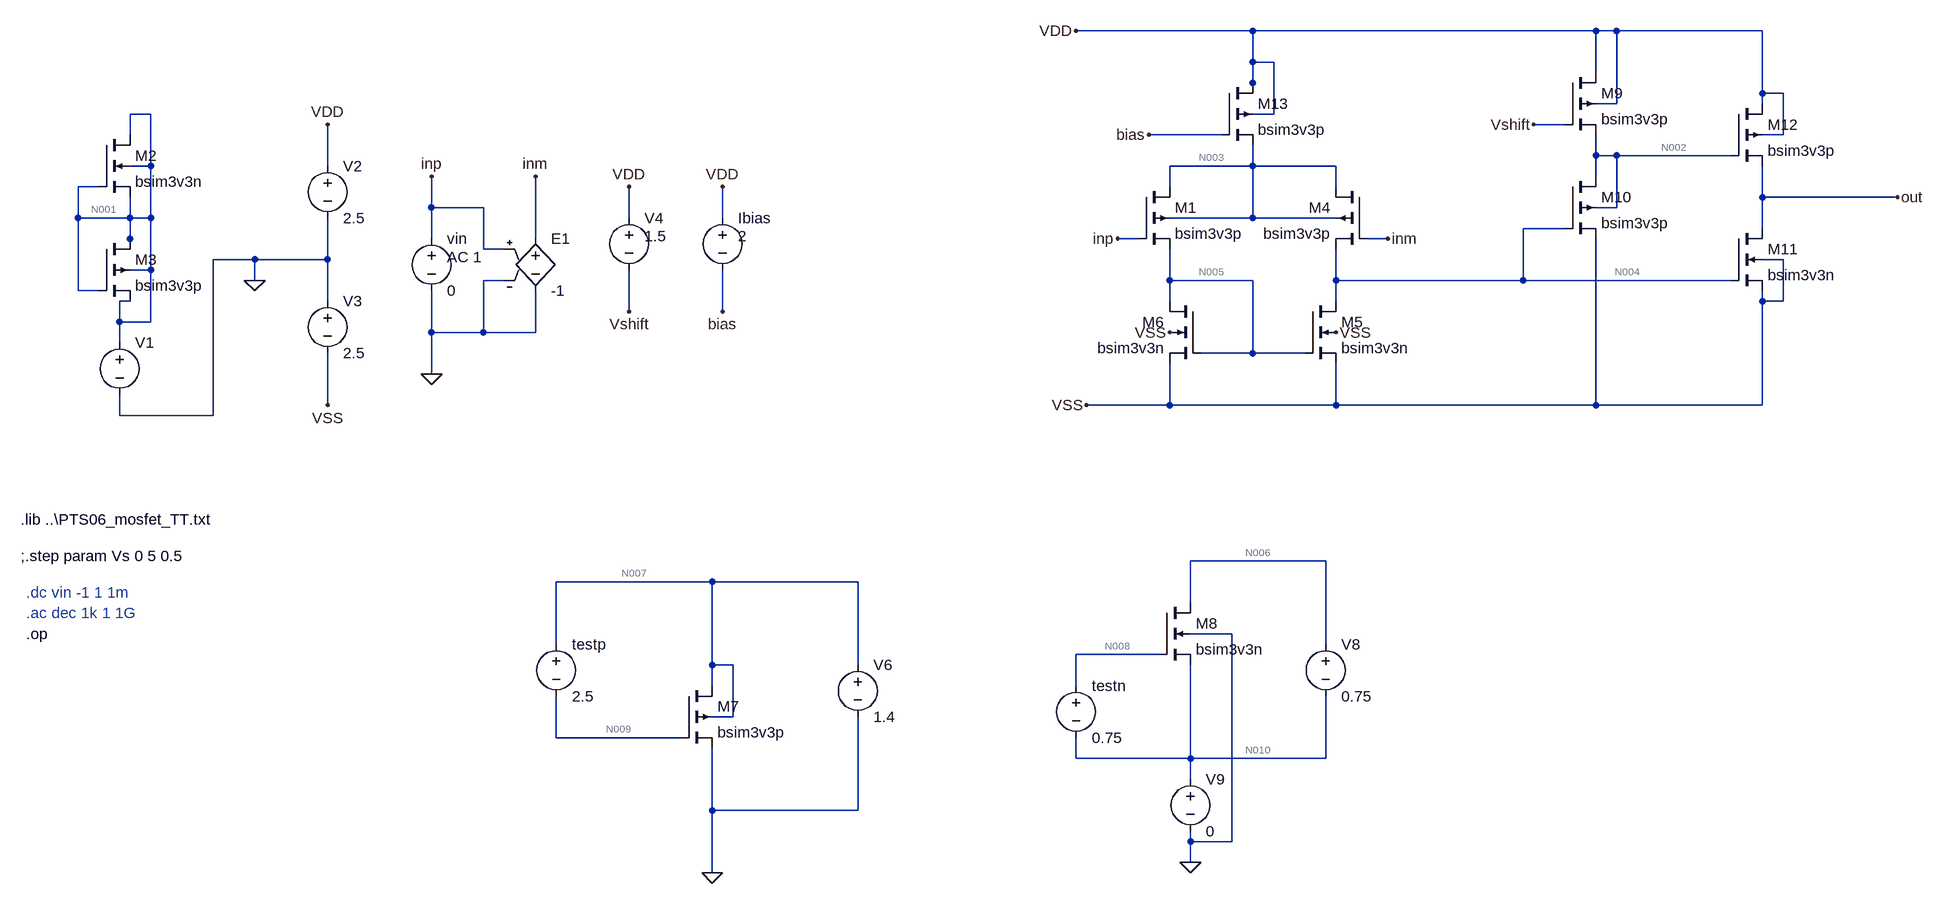
[diagram p0: schematic basic.asc]
basic.asc, the LTspice schematic file:
Version 4
SHEET 1 2424 680
WIRE 1376 -768 1104 -768
WIRE 1904 -768 1376 -768
WIRE 1936 -768 1904 -768
WIRE 2160 -768 1936 -768
WIRE 1376 -720 1376 -768
WIRE 1408 -720 1376 -720
WIRE 1904 -704 1904 -768
WIRE 1376 -688 1376 -720
WIRE 1376 -672 1376 -688
WIRE 2160 -672 2160 -768
WIRE 2192 -672 2160 -672
WIRE 1936 -656 1936 -768
WIRE 1936 -656 1904 -656
WIRE 2160 -656 2160 -672
WIRE -320 -640 -352 -640
WIRE 1408 -640 1408 -720
WIRE 1408 -640 1376 -640
WIRE 1856 -624 1808 -624
WIRE -352 -608 -352 -640
WIRE 1328 -608 1216 -608
WIRE 2192 -608 2192 -672
WIRE 2192 -608 2160 -608
WIRE 1904 -576 1904 -608
WIRE 1936 -576 1904 -576
WIRE 2112 -576 1936 -576
WIRE -320 -560 -320 -640
WIRE -320 -560 -352 -560
WIRE -48 -560 -48 -624
WIRE 1376 -560 1376 -592
WIRE 1376 -560 1248 -560
WIRE 1504 -560 1376 -560
WIRE 1904 -544 1904 -576
WIRE -400 -528 -432 -528
WIRE 1248 -528 1248 -560
WIRE 1504 -528 1504 -560
WIRE 2160 -512 2160 -560
WIRE 2368 -512 2160 -512
WIRE 112 -496 112 -544
WIRE 192 -496 112 -496
WIRE 1936 -496 1936 -576
WIRE 1936 -496 1904 -496
WIRE -432 -480 -432 -528
WIRE -352 -480 -352 -512
WIRE -352 -480 -432 -480
WIRE -320 -480 -320 -560
WIRE -320 -480 -352 -480
WIRE 416 -480 416 -528
WIRE 560 -480 560 -528
WIRE 1376 -480 1376 -560
WIRE 1376 -480 1248 -480
WIRE 1504 -480 1376 -480
WIRE 1856 -464 1792 -464
WIRE 2160 -464 2160 -512
WIRE -352 -448 -352 -480
WIRE 112 -448 112 -496
WIRE 272 -448 272 -544
WIRE 1200 -448 1168 -448
WIRE 1584 -448 1552 -448
WIRE -352 -432 -352 -448
WIRE 192 -432 192 -496
WIRE 224 -432 192 -432
WIRE -160 -416 -224 -416
WIRE -48 -416 -48 -480
WIRE -48 -416 -160 -416
WIRE 2192 -416 2160 -416
WIRE -320 -400 -320 -480
WIRE -320 -400 -352 -400
WIRE -160 -384 -160 -416
WIRE 224 -384 192 -384
WIRE 1248 -384 1248 -432
WIRE 1376 -384 1248 -384
WIRE 1504 -384 1504 -432
WIRE 1792 -384 1792 -464
WIRE 1792 -384 1504 -384
WIRE 2112 -384 1792 -384
WIRE -432 -368 -432 -480
WIRE -400 -368 -432 -368
WIRE -352 -352 -368 -352
WIRE -48 -352 -48 -416
WIRE 1248 -352 1248 -384
WIRE 1504 -352 1504 -384
WIRE 2160 -352 2160 -368
WIRE 2192 -352 2192 -416
WIRE 2192 -352 2160 -352
WIRE 416 -336 416 -400
WIRE 560 -336 560 -400
WIRE -368 -320 -368 -352
WIRE -320 -320 -320 -400
WIRE -320 -320 -368 -320
WIRE 112 -304 112 -368
WIRE 192 -304 192 -384
WIRE 192 -304 112 -304
WIRE 272 -304 272 -368
WIRE 272 -304 192 -304
WIRE -368 -288 -368 -320
WIRE 1376 -272 1376 -384
WIRE 1376 -272 1296 -272
WIRE 1456 -272 1376 -272
WIRE 112 -240 112 -304
WIRE -48 -192 -48 -272
WIRE 1248 -192 1248 -256
WIRE 1248 -192 1120 -192
WIRE 1504 -192 1504 -256
WIRE 1504 -192 1248 -192
WIRE 1904 -192 1904 -448
WIRE 1904 -192 1504 -192
WIRE 2160 -192 2160 -352
WIRE 2160 -192 1904 -192
WIRE -368 -176 -368 -208
WIRE -224 -176 -224 -416
WIRE -224 -176 -368 -176
WIRE 1488 48 1280 48
WIRE 544 80 304 80
WIRE 768 80 544 80
WIRE 1280 112 1280 48
WIRE 1344 160 1280 160
WIRE 304 176 304 80
WIRE 1488 176 1488 48
WIRE 1232 192 1104 192
WIRE 544 208 544 80
WIRE 576 208 544 208
WIRE 768 208 768 80
WIRE 544 240 544 208
WIRE 1104 240 1104 192
WIRE 576 288 576 208
WIRE 576 288 544 288
WIRE 304 320 304 256
WIRE 496 320 304 320
WIRE 1104 352 1104 320
WIRE 1280 352 1280 208
WIRE 1280 352 1104 352
WIRE 1488 352 1488 256
WIRE 1488 352 1280 352
WIRE 1280 384 1280 352
WIRE 544 432 544 336
WIRE 768 432 768 288
WIRE 768 432 544 432
WIRE 1280 480 1280 464
WIRE 1344 480 1344 160
WIRE 1344 480 1280 480
WIRE 1280 512 1280 480
WIRE 544 528 544 432
FLAG -160 -384 0
FLAG -48 -192 VSS
FLAG -48 -624 VDD
FLAG 112 -240 0
FLAG 112 -544 inp
FLAG 272 -544 inm
FLAG 1248 -304 VSS
FLAG 1504 -304 VSS
FLAG 1120 -192 VSS
FLAG 1104 -768 VDD
FLAG 1168 -448 inp
FLAG 1584 -448 inm
FLAG 416 -528 VDD
FLAG 416 -336 Vshift
FLAG 1808 -624 Vshift
FLAG 2368 -512 out
FLAG 544 528 0
FLAG 1280 512 0
FLAG 560 -528 VDD
FLAG 560 -336 bias
FLAG 1216 -608 bias
DATAFLAG 1360 -384 ""
DATAFLAG 1344 -560 ""
DATAFLAG 1648 -384 ""
DATAFLAG 2016 -576 ""
DATAFLAG 2256 -512 ""
DATAFLAG 1696 -192 ""
DATAFLAG 1664 -768 ""
SYMBOL nmos4 -400 -608 R0
SYMATTR InstName M2
SYMATTR Value bsim3v3n
SYMATTR Value2 l=0.6u w=1.2u
SYMBOL pmos4 -400 -448 R0
SYMATTR InstName M3
SYMATTR Value bsim3v3p
SYMATTR Value2 l=0.6u w=1.2u
SYMBOL voltage -368 -304 R0
WINDOW 123 0 0 Left 0
WINDOW 39 0 0 Left 0
SYMATTR InstName V1
SYMATTR Value ""
SYMBOL voltage -48 -576 R0
WINDOW 123 0 0 Left 0
WINDOW 39 0 0 Left 0
SYMATTR InstName V2
SYMATTR Value 2.5
SYMBOL voltage -48 -368 R0
WINDOW 123 0 0 Left 0
WINDOW 39 0 0 Left 0
SYMATTR InstName V3
SYMATTR Value 2.5
SYMBOL voltage 112 -464 R0
WINDOW 123 24 44 Left 2
WINDOW 39 0 0 Left 0
SYMATTR Value2 AC 1
SYMATTR InstName vin
SYMATTR Value 0
SYMBOL e 272 -464 R0
SYMATTR InstName E1
SYMATTR Value -1
SYMBOL pmos4 1200 -528 R0
SYMATTR InstName M1
SYMATTR Value bsim3v3p
SYMATTR Value2 l=0.6u w=1.2u
SYMBOL pmos4 1552 -528 M0
SYMATTR InstName M4
SYMATTR Value bsim3v3p
SYMATTR Value2 l=0.6u w=1.2u
SYMBOL nmos4 1456 -352 R0
SYMATTR InstName M5
SYMATTR Value bsim3v3n
SYMATTR Value2 l=4.6u w=1.2u
SYMBOL nmos4 1296 -352 M0
SYMATTR InstName M6
SYMATTR Value bsim3v3n
SYMATTR Value2 l=4.6u w=1.2u
SYMBOL pmos4 1856 -704 R0
SYMATTR InstName M9
SYMATTR Value bsim3v3p
SYMATTR Value2 l=0.6u w=1.2
SYMBOL pmos4 1856 -544 R0
SYMATTR InstName M10
SYMATTR Value bsim3v3p
SYMATTR Value2 l=0.6u w=2.4u
SYMBOL nmos4 2112 -464 R0
SYMATTR InstName M11
SYMATTR Value bsim3v3n
SYMATTR Value2 l=0.6u w=1.2u
SYMBOL pmos4 2112 -656 R0
SYMATTR InstName M12
SYMATTR Value bsim3v3p
SYMATTR Value2 l=0.6u w=1.2u
SYMBOL voltage 416 -496 R0
WINDOW 123 0 0 Left 0
WINDOW 39 0 0 Left 0
WINDOW 3 24 44 Left 2
SYMATTR InstName V4
SYMATTR Value 1.5
SYMBOL nmos4 1232 112 R0
SYMATTR InstName M8
SYMATTR Value bsim3v3n
SYMATTR Value2 l=12u w=1.2u
SYMBOL voltage 304 160 R0
WINDOW 123 0 0 Left 0
WINDOW 39 0 0 Left 0
SYMATTR InstName testp
SYMATTR Value 2.5
SYMBOL voltage 768 192 R0
WINDOW 123 0 0 Left 0
WINDOW 39 0 0 Left 0
SYMATTR InstName V6
SYMATTR Value 1.4
SYMBOL voltage 1104 224 R0
WINDOW 123 0 0 Left 0
WINDOW 39 0 0 Left 0
SYMATTR InstName testn
SYMATTR Value 0.75
SYMBOL voltage 1488 160 R0
WINDOW 123 0 0 Left 0
WINDOW 39 0 0 Left 0
SYMATTR InstName V8
SYMATTR Value 0.75
SYMBOL voltage 1280 368 R0
WINDOW 123 0 0 Left 0
WINDOW 39 0 0 Left 0
SYMATTR InstName V9
SYMATTR Value 0
SYMBOL pmos4 496 240 R0
SYMATTR InstName M7
SYMATTR Value bsim3v3p
SYMATTR Value2 l=5.1u w=1.2u
SYMBOL pmos4 1328 -688 R0
SYMATTR InstName M13
SYMATTR Value bsim3v3p
SYMATTR Value2 l=5.1u w=1.2u
SYMBOL voltage 560 -496 R0
WINDOW 123 0 0 Left 0
WINDOW 39 0 0 Left 0
WINDOW 3 24 44 Left 2
SYMATTR InstName Ibias
SYMATTR Value 2
TEXT -520 -16 Left 2 !.lib ..\\PTS06_mosfet_TT.txt
TEXT -520 40 Left 2 !;.step param Vs 0 5 0.5
TEXT -512 96 Left 2 ;.dc vin -1 1 1m
TEXT -512 128 Left 2 ;.ac dec 1k 1 1G
TEXT -512 160 Left 2 !.op

The netlist it stands for:
* basic.asc
M2 N001 N001 N001 N001 bsim3v3n l=0.6u w=1.2u
M3 N001 N001 N001 N001 bsim3v3p l=0.6u w=1.2u
V1 N001 0
V2 VDD 0 2.5
V3 0 VSS 2.5
vin inp 0 0 AC 1
E1 inm 0 inp 0 -1
M1 N003 inp N005 N003 bsim3v3p l=0.6u w=1.2u
M4 N003 inm N004 N003 bsim3v3p l=0.6u w=1.2u
M5 N004 N005 VSS VSS bsim3v3n l=4.6u w=1.2u
M6 N005 N005 VSS VSS bsim3v3n l=4.6u w=1.2u
M9 VDD Vshift N002 VDD bsim3v3p l=0.6u w=1.2
M10 N002 N004 VSS N002 bsim3v3p l=0.6u w=2.4u
M11 out N004 VSS VSS bsim3v3n l=0.6u w=1.2u
M12 VDD N002 out VDD bsim3v3p l=0.6u w=1.2u
V4 VDD Vshift 1.5
M8 N006 N008 N010 0 bsim3v3n l=12u w=1.2u
V§testp N007 N009 2.5
V6 N007 0 1.4
V§testn N008 N010 0.75
V8 N006 N010 0.75
V9 N010 0 0
M7 N007 N009 0 N007 bsim3v3p l=5.1u w=1.2u
M13 VDD bias N003 VDD bsim3v3p l=5.1u w=1.2u
V§Ibias VDD bias 2
.model NMOS NMOS
.model PMOS PMOS
.lib standard.mos
.lib ..\PTS06_mosfet_TT.txt
;.step param Vs 0 5 0.5
* .dc vin -1 1 1m
* .ac dec 1k 1 1G
.op
.backanno
.end

* Results of the author's LTspice run, read from the files saved beside the schematic
* Operating Point:
*   V(n001) = 0 V
*   V(vdd) = 2.5 V
*   V(vss) = -2.5 V
*   V(inp) = 0 V
*   V(inm) = 0 V
*   V(n003) = 1.108 V
*   V(n005) = -1.485 V
*   V(n004) = -1.485 V
*   V(vshift) = 1 V
*   V(n002) = 2.5 V
*   V(out) = -2.5 V
*   V(n006) = 750 mV
*   V(n008) = 750 mV
*   V(n010) = 0 V
*   V(n007) = 1.4 V
*   V(n009) = -1.1 V
*   V(bias) = 500 mV
*   Id(M1) = 881.5 nA
*   Ig(M1) = 0 A
*   Ib(M1) = 2.672 pA
*   Is(M1) = -881.5 nA
*   Id(M4) = 881.5 nA
*   Ig(M4) = 0 A
*   Ib(M4) = 2.672 pA
*   Is(M4) = -881.5 nA
*   Id(M9) = 257 µA
*   Ig(M9) = 0 A
*   Ib(M9) = 0 A
*   Is(M9) = -257 µA
*   Id(M10) = 257 µA
*   Ig(M10) = 0 A
*   Ib(M10) = 236.3 pA
*   Is(M10) = -257 µA
*   Id(M12) = 0 A
*   Ig(M12) = 0 A
*   Ib(M12) = 5.01 pA
*   Is(M12) = -5.01 pA
*   Id(M7) = 3.608 µA
*   Ig(M7) = 0 A
*   Ib(M7) = 1.41 pA
*   Is(M7) = -3.608 µA
*   Id(M13) = 1.763 µA
*   Ig(M13) = 0 A
*   Ib(M13) = 1.402 pA
*   Is(M13) = -1.763 µA
*   Id(M5) = 881.5 nA
*   Ig(M5) = 0 A
*   Ib(M5) = -1.025 pA
*   Is(M5) = -881.5 nA
*   Id(M6) = 881.5 nA
*   Ig(M6) = 0 A
*   Ib(M6) = -1.025 pA
*   Is(M6) = -881.5 nA
*   Id(M11) = 5.01 pA
*   Ig(M11) = 0 A
*   Ib(M11) = 0 A
*   Is(M11) = -5.01 pA
*   Id(M8) = 45.37 nA
*   Ig(M8) = 0 A
*   Ib(M8) = -760 fA
*   Is(M8) = -45.37 nA
*   I(E1) = 0 A
*   I(V1) = 0 A
*   I(V2) = -258.8 µA
*   I(V3) = -258.8 µA
*   I(Vin) = 0 A
*   I(V4) = 0 A
*   I(Testp) = 0 A
*   I(V6) = -3.608 µA
*   I(Testn) = 0 A
*   I(V8) = -45.37 nA
*   I(V9) = -760 fA
*   I(Ibias) = 0 A
* From the log:
*   Semiconductor Device Operating Points:
*                           --- BSIM3 MOSFETS ---
*   Name:        m1          m4          m9          m10         m12
*   Model:    bsim3v3p    bsim3v3p    bsim3v3p    bsim3v3p    bsim3v3p
*   Id:        8.82e-07    8.82e-07    2.57e-04    2.57e-04    3.80e-16
*   Vgs:       1.49e+00    1.49e+00   -1.50e+00    1.01e+00    5.00e+00
*   Vds:       2.59e+00    2.59e+00    8.25e-06    5.00e+00    5.00e+00
*   Vbs:       2.59e+00    2.59e+00    8.25e-06    5.00e+00    5.00e+00
*   Vth:      -8.97e-01   -8.97e-01   -8.77e-01   -8.43e-01   -8.93e-01
*   Vdsat:    -2.12e-01   -2.12e-01   -5.56e-01   -2.40e+00   -4.20e-02
*   Gm:        6.83e-06    6.83e-06    3.90e-04    1.26e-04    8.83e-15
*   Gds:       6.47e-08    6.47e-08    3.12e+01    7.03e-06    5.25e-17
*   Gmb        2.06e-06    2.06e-06    1.39e-04    3.22e-05    4.00e-15
*   Cbd:       0.00e+00    0.00e+00    0.00e+00    0.00e+00    0.00e+00
*   Cbs:       0.00e+00    0.00e+00    0.00e+00    0.00e+00    0.00e+00
*   Cgsov:     2.71e-16    2.71e-16    4.59e-10    7.05e-16    2.71e-16
*   Cgdov:     2.71e-16    2.71e-16    4.59e-10    7.05e-16    2.71e-16
*   Cgbov:     9.98e-16    9.98e-16    9.98e-16    9.98e-16    9.98e-16
*   dQgdVgb:   2.45e-15    2.45e-15    2.85e-09    4.77e-15    2.01e-15
*   dQgdVdb:  -2.70e-16   -2.70e-16   -1.38e-09   -7.02e-16   -2.71e-16
*   dQgdVsb:  -1.03e-15   -1.03e-15   -1.34e-09   -2.94e-15   -2.71e-16
*   dQddVgb:  -5.73e-16   -5.73e-16   -1.42e-09   -1.50e-15   -2.71e-16
*   dQddVdb:   2.71e-16    2.71e-16    1.40e-09    7.04e-16    2.71e-16
*   dQddVsb:   3.93e-16    3.93e-16    2.97e-10    1.02e-15    4.52e-25
*   dQbdVgb:  -1.15e-15   -1.15e-15   -4.04e-12   -1.38e-15   -1.47e-15
*   dQbdVdb:   3.10e-19    3.10e-19   -5.01e-10    7.46e-19    5.52e-28
*   dQbdVsb:  -2.20e-16   -2.20e-16   -1.91e-10   -3.18e-16    1.56e-20
*   Name:        m7          m13         m5          m6          m11
*   Model:    bsim3v3p    bsim3v3p    bsim3v3n    bsim3v3n    bsim3v3n
*   Id:        3.61e-06    1.76e-06    8.82e-07    8.82e-07    5.01e-12
*   Vgs:      -1.10e+00   -6.08e-01    1.01e+00    1.01e+00    1.01e+00
*   Vds:       1.40e+00    1.39e+00    1.01e+00    1.01e+00    1.64e-07
*   Vbs:       1.40e+00    1.39e+00    0.00e+00    0.00e+00    0.00e+00
*   Vth:      -9.34e-01   -9.34e-01    6.42e-01    6.42e-01    7.68e-01
*   Vdsat:    -1.21e+00   -8.32e-01    2.78e-01    2.78e-01    2.00e-01
*   Gm:        4.21e-06    3.11e-06    4.42e-06    4.42e-06    2.16e-11
*   Gds:       1.55e-07    2.42e-08    8.17e-09    8.17e-09    3.05e-05
*   Gmb        1.32e-06    9.81e-07    2.09e-06    2.09e-06    1.12e-11
*   Cbd:       0.00e+00    0.00e+00    0.00e+00    0.00e+00    0.00e+00
*   Cbs:       0.00e+00    0.00e+00    0.00e+00    0.00e+00    0.00e+00
*   Cgsov:     2.71e-16    2.71e-16    2.95e-16    2.95e-16    2.95e-16
*   Cgdov:     2.71e-16    2.71e-16    2.95e-16    2.95e-16    2.95e-16
*   Cgbov:     8.20e-15    8.20e-15    6.55e-15    6.55e-15    9.75e-16
*   dQgdVgb:   1.61e-14    1.60e-14    1.32e-14    1.32e-14    2.69e-15
*   dQgdVdb:  -3.33e-16   -2.81e-16   -2.97e-16   -2.97e-16   -7.83e-16
*   dQgdVsb:  -7.29e-15   -7.15e-15   -5.70e-15   -5.70e-15   -9.04e-16
*   dQddVgb:  -2.83e-15   -2.78e-15   -2.31e-15   -2.31e-15   -8.57e-16
*   dQddVdb:   3.43e-16    2.82e-16    2.97e-16    2.97e-16    8.95e-16
*   dQddVsb:   3.31e-15    3.31e-15    3.04e-15    3.04e-15    2.35e-16
*   dQbdVgb:  -9.20e-15   -9.22e-15   -7.59e-15   -7.59e-15   -9.79e-16
*   dQbdVdb:  -2.97e-17   -4.46e-18   -1.06e-18   -1.06e-18   -4.12e-16
*   dQbdVsb:  -1.26e-15   -1.40e-15   -2.18e-15   -2.18e-15   -1.61e-16
*   Name:        m8
*   Model:    bsim3v3n
*   Id:        4.54e-08
*   Vgs:       7.50e-01
*   Vds:       7.50e-01
*   Vbs:       0.00e+00
*   Vth:       6.31e-01
*   Vdsat:     1.17e-01
*   Gm:        5.27e-07
*   Gds:       3.64e-10
*   Gmb        2.62e-07
*   Cbd:       0.00e+00
*   Cbs:       0.00e+00
*   Cgsov:     2.95e-16
*   Cgdov:     2.95e-16
*   Cgbov:     1.71e-14
*   dQgdVgb:   3.31e-14
*   dQgdVdb:  -2.97e-16
*   dQgdVsb:  -1.36e-14
*   dQddVgb:  -5.37e-15
*   dQddVdb:   2.98e-16
*   dQddVsb:   7.68e-15
*   dQbdVgb:  -1.98e-14
*   dQbdVdb:  -1.37e-18
*   dQbdVsb:  -5.84e-15